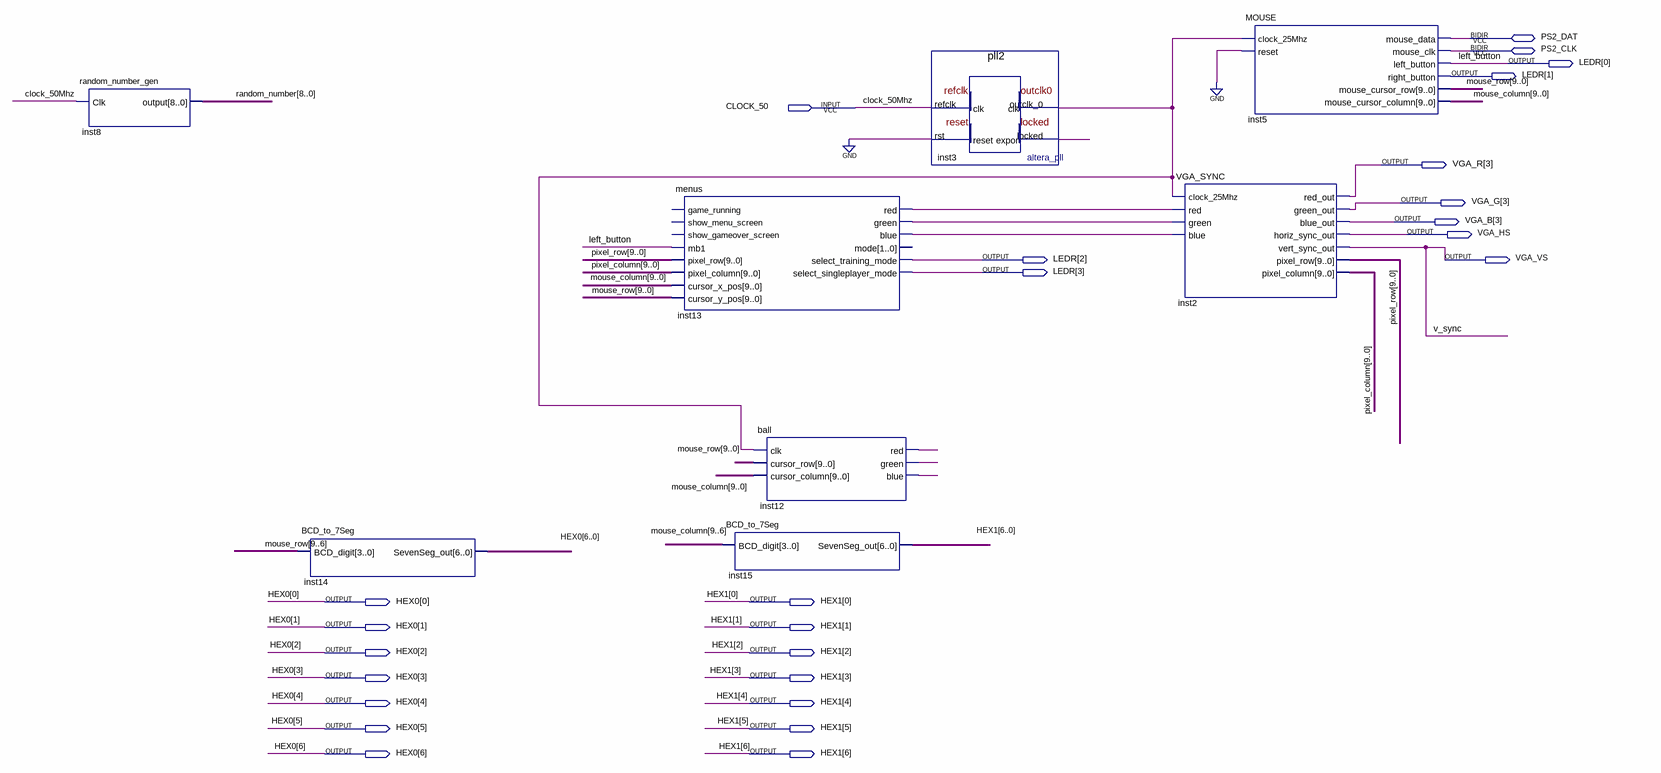
[diagram p0: schematic sheet]
// Quartus schematic home_screen_block_diagram.bdf as structural Verilog: 8 symbols, 26 pins
module home_screen_block_diagram (
  input  CLOCK_50,
  inout  PS2_DAT,
  inout  PS2_CLK,
  output [3:0] LEDR,
  output [3:3] VGA_R,
  output [3:3] VGA_G,
  output [3:3] VGA_B,
  output VGA_HS,
  output VGA_VS,
  output [6:0] HEX0,
  output [6:0] HEX1
);

  wire inst3_locked, inst3_outclk_0, inst12_blue, inst12_green, inst12_red, inst13_blue, inst13_green,
       inst13_red;
  wire [8:0] random_number;
  wire [9:0] mouse_column, mouse_row, pixel_column, pixel_row;

  random_number_gen inst8 (.Clk(CLOCK_50), .\output (random_number));
  BCD_to_7Seg inst14 (.BCD_digit(mouse_row[9:6]), .SevenSeg_out(HEX0));
  menus inst13 (
    .mb1(LEDR[0]), .pixel_row(pixel_row), .pixel_column(pixel_column), .cursor_x_pos(mouse_column),
    .cursor_y_pos(mouse_row), .red(inst13_red), .green(inst13_green), .blue(inst13_blue),
    .select_training_mode(LEDR[2]), .select_singleplayer_mode(LEDR[3]));  // open: game_running, show_menu_screen, show_gameover_screen, mode
  BCD_to_7Seg inst15 (.BCD_digit(mouse_column[9:6]), .SevenSeg_out(HEX1));
  ball inst12 (
    .clk(inst3_outclk_0), .cursor_row(mouse_row), .cursor_column(mouse_column), .red(inst12_red),
    .green(inst12_green), .blue(inst12_blue));
  pll2 inst3 (.refclk(CLOCK_50), .rst(1'b0), .outclk_0(inst3_outclk_0), .locked(inst3_locked));
  VGA_SYNC inst2 (
    .clock_25Mhz(inst3_outclk_0), .red(inst13_red), .green(inst13_green), .blue(inst13_blue),
    .red_out(VGA_R[3]), .green_out(VGA_G[3]), .blue_out(VGA_B[3]), .horiz_sync_out(VGA_HS),
    .vert_sync_out(VGA_VS), .pixel_row(pixel_row), .pixel_column(pixel_column));
  MOUSE inst5 (
    .clock_25Mhz(inst3_outclk_0), .reset(1'b0), .left_button(LEDR[0]), .right_button(LEDR[1]),
    .mouse_cursor_row(mouse_row), .mouse_cursor_column(mouse_column), .mouse_data(PS2_DAT),
    .mouse_clk(PS2_CLK));

  // Other names for the same wires on the sheet: clock_50Mhz = CLOCK_50; left_button = LEDR[0]; v_sync = VGA_VS
endmodule
